# Altium schematic sheet Sheet4.SchDoc
size A4
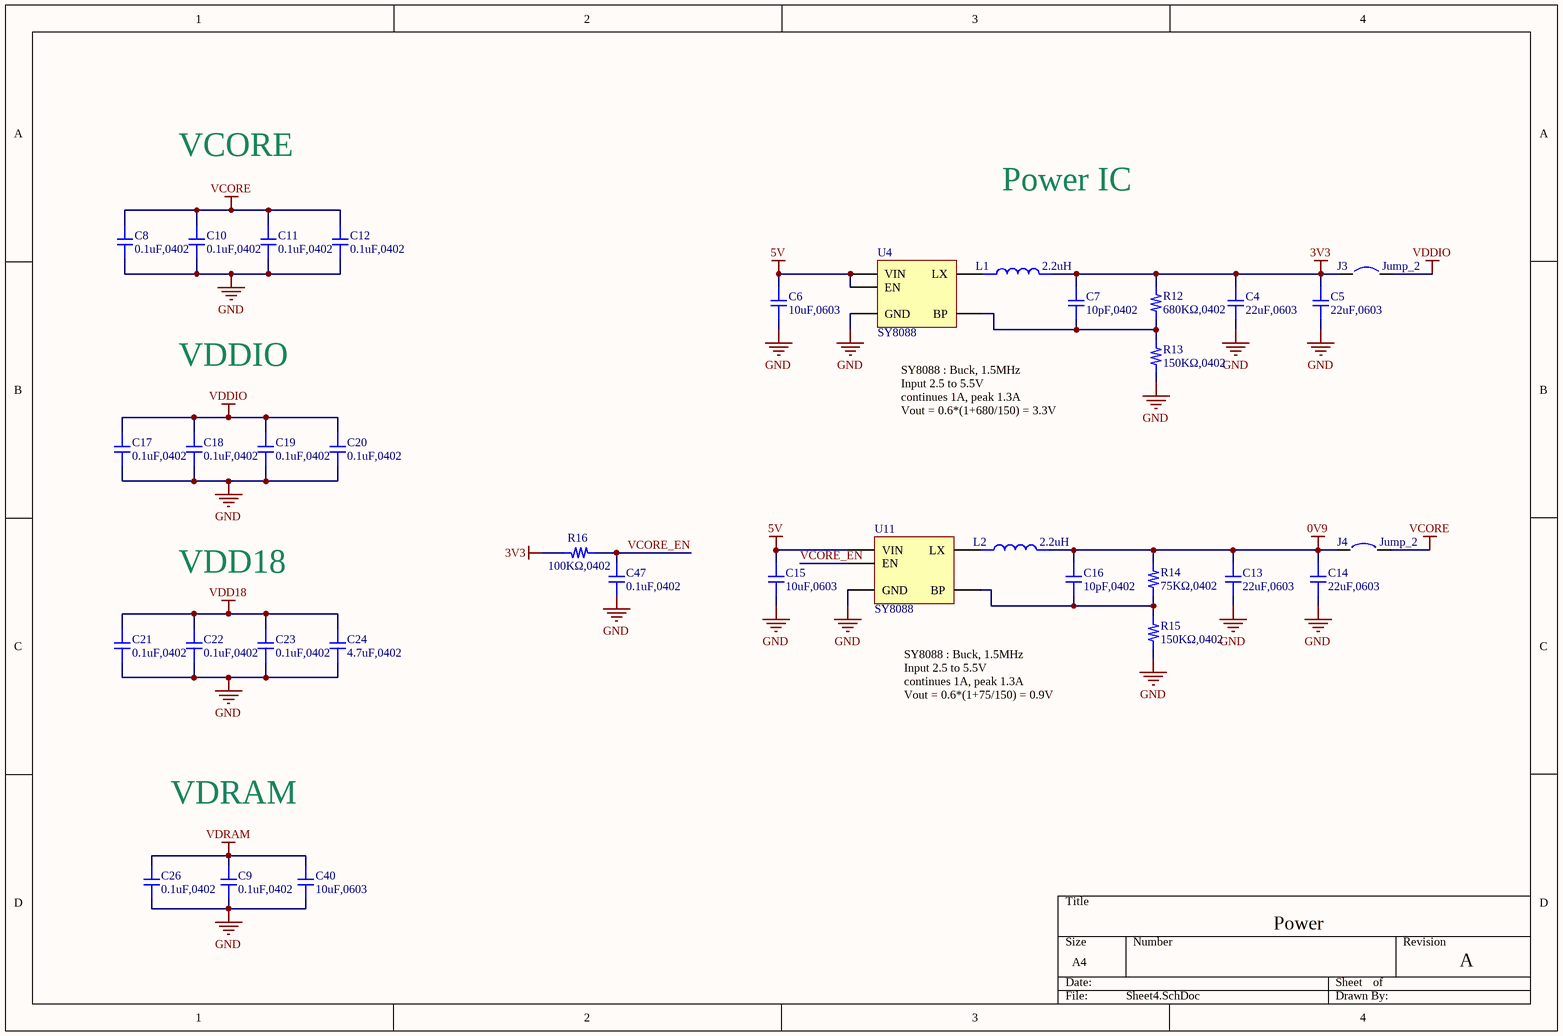
[diagram p0: Sheet4.SchDoc]

## Parts
C4  22uF,0603  [C0603]
C5  22uF,0603  [C0603]
C6  10uF,0603  [C0603]
C7  10pF,0402  [C0402]
C8  0.1uF,0402  [C0402]
C9  0.1uF,0402  [C0402]
C10  0.1uF,0402  [C0402]
C11  0.1uF,0402  [C0402]
C12  0.1uF,0402  [C0402]
C13  22uF,0603  [C0603]
C14  22uF,0603  [C0603]
C15  10uF,0603  [C0603]
C16  10pF,0402  [C0402]
C17  0.1uF,0402  [C0402]
C18  0.1uF,0402  [C0402]
C19  0.1uF,0402  [C0402]
C20  0.1uF,0402  [C0402]
C21  0.1uF,0402  [C0402]
C22  0.1uF,0402  [C0402]
C23  0.1uF,0402  [C0402]
C24  4.7uF,0402  [C0402]
C26  0.1uF,0402  [C0402]
C40  10uF,0603  [C0603]
C47  0.1uF,0402  [C0402]
J3  Jump_2  [Jp0603]
J4  Jump_2  [Jp0603]
L1  2.2uH  [IND_252010_SMD]
L2  2.2uH  [IND_252010_SMD]
R12  680KΩ,0402  [R0402]
R13  150KΩ,0402  [R0402]
R14  75KΩ,0402  [R0402]
R15  150KΩ,0402  [R0402]
R16  100KΩ,0402  [R0402]
U4  SY8088  [SOT-23-5p]
U11  SY8088  [SOT-23-5p]

## Nets
0V9: C13.02 C14.02 C16.01 J4.01 L2.02 R14.01
3V3: C4.02 C5.02 C7.01 J3.01 L1.02 R12.01 R16.02
5V: C6.01 C15.01 U4.01(EN) U4.04(VIN) U11.04(VIN)
GND: C4.01 C5.01 C6.02 C8.01 C9.01 C10.01 C11.01 C12.01 C13.01 C14.01 C15.02 C17.01 C18.01 C19.01 C20.01 C21.01 C22.01 C23.01 C24.01 C26.01 C40.01 C47.01 R13.01 R15.01 U4.02(GND) U11.02(GND)
VCORE: C8.02 C10.02 C11.02 C12.02 J4.02
VDD18: C21.02 C22.02 C23.02 C24.02
VDDIO: C17.02 C18.02 C19.02 C20.02 J3.02
VDRAM: C9.02 C26.02 C40.02
VCORE_EN: C47.02 R16.01 U11.01(EN)
NetC7_02: C7.02 R12.02 R13.02 U4.05(BP)
NetC16_02: C16.02 R14.02 R15.02 U11.05(BP)
NetL1_01: L1.01 U4.03(LX)
NetL2_01: L2.01 U11.03(LX)

## Notes on the sheet
- VCORE
- Power IC
- VDDIO
- SY8088 : Buck, 1.5MHz
  Input 2.5 to 5.5V
  continues 1A, peak 1.3A
  Vout = 0.6*(1+680/150) = 3.3V
- VDD18
- SY8088 : Buck, 1.5MHz
  Input 2.5 to 5.5V
  continues 1A, peak 1.3A
  Vout = 0.6*(1+75/150) = 0.9V
- VDRAM
- Power
- A

## Library data of the parts
C4-C24 C26 C40 C47 = Cap
L1 L2 = Ind
R12-R16 = Res